# EAGLE design V15_USB_isolator (EAGLE 9.3.0)
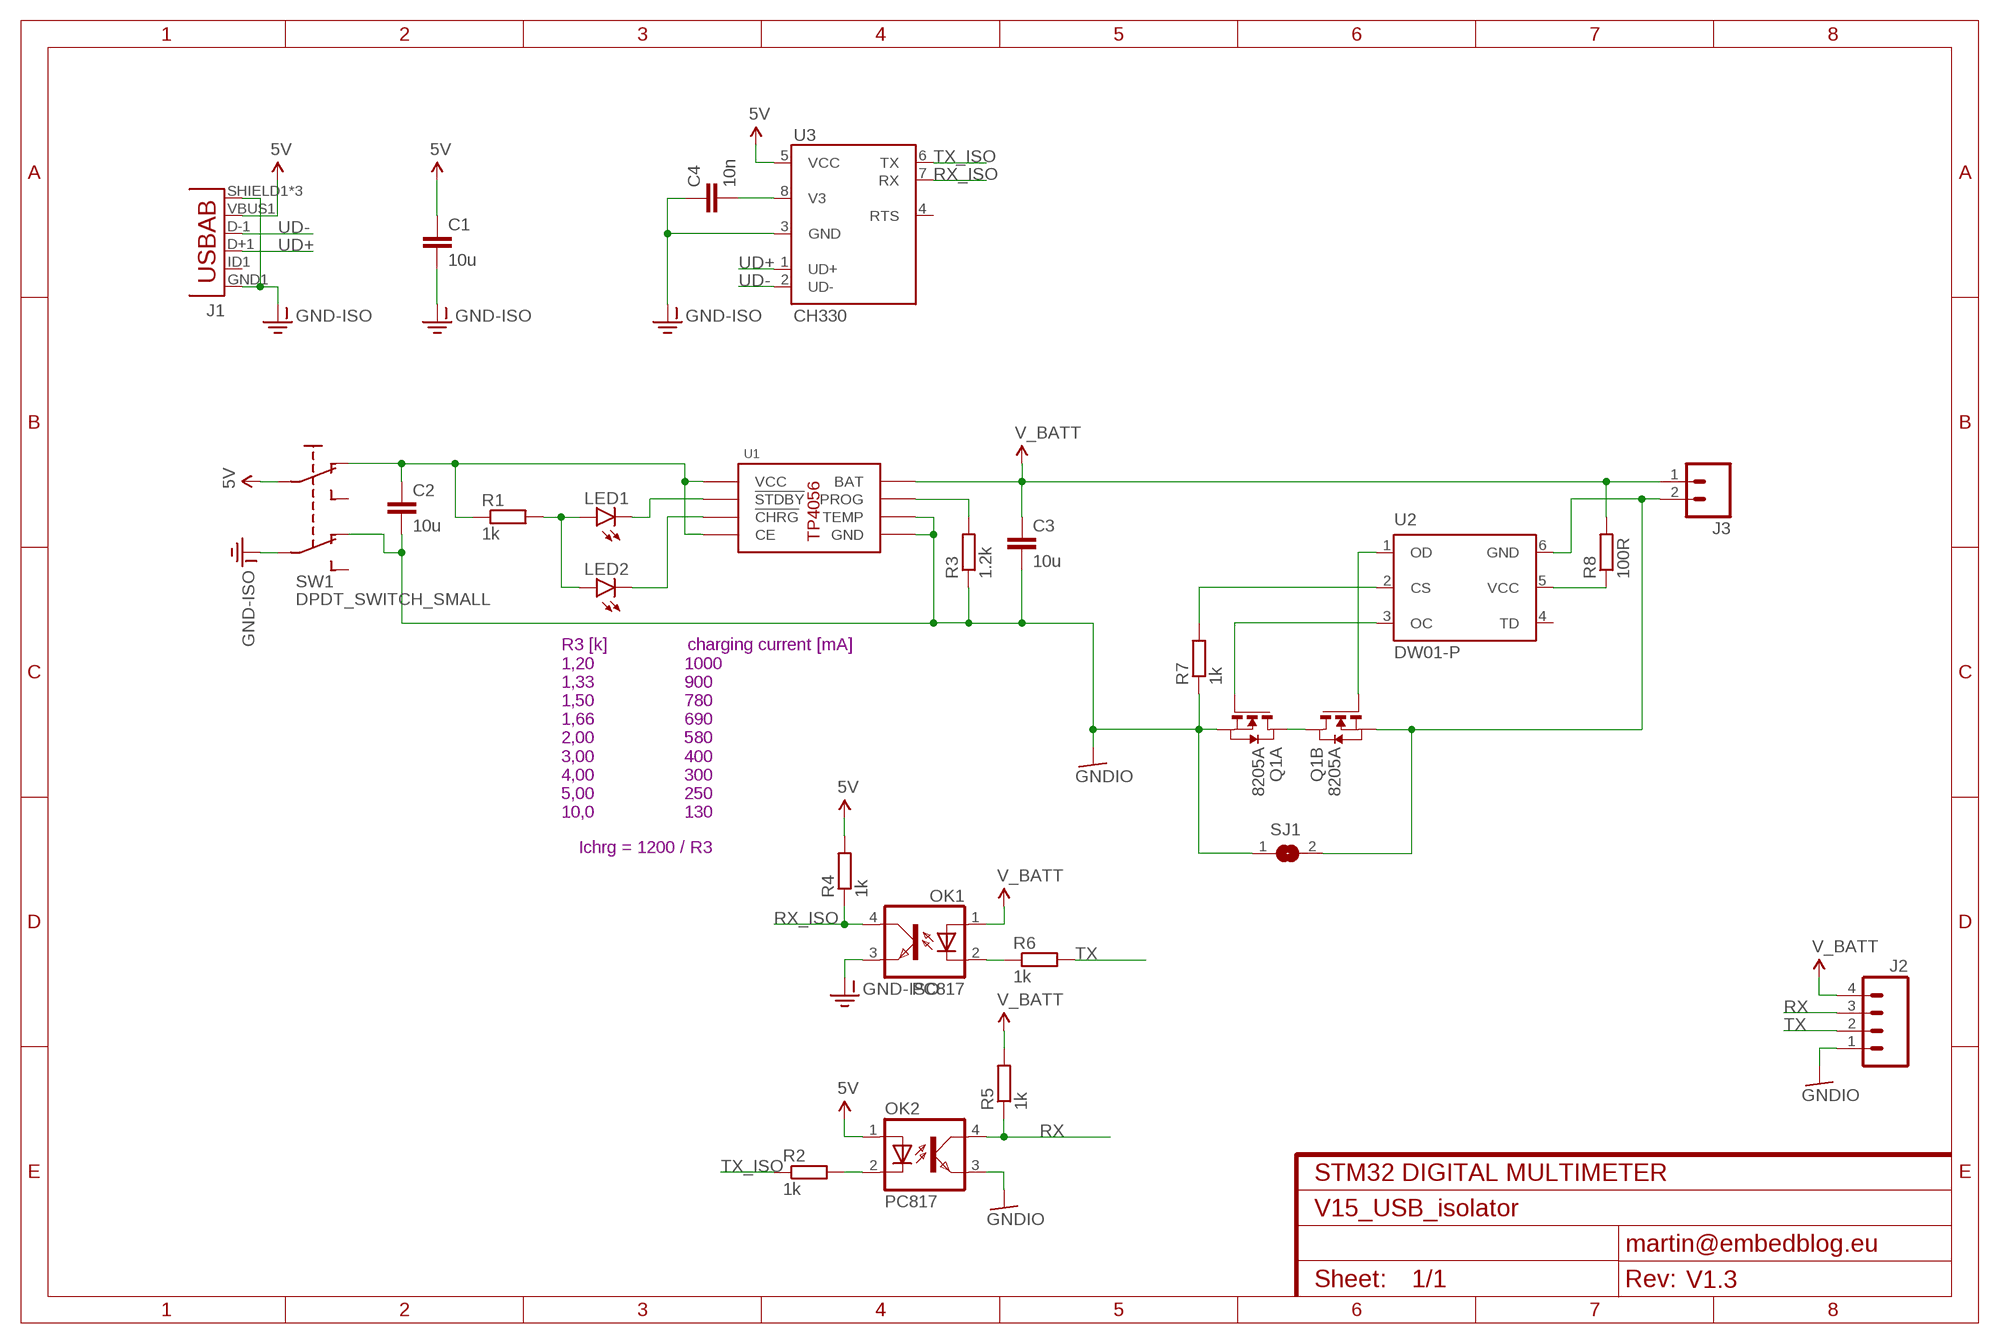
[diagram p0: schematic, sheet 1]
FRAME1 (FRAME-A4L): CNAME: STM32 DIGITAL MULTIMETER; CREVISION: V1.3; DESIGNER: martin@embedblog.eu

## Parts
C1  10u  C-EUC1206  [C1206]
C2  10u  C-EUC1206  [C1206]
C3  10u  C-EUC1206  [C1206]
C4  10n  C-EUC1206  [C1206]
J1  USB-ABCONN-11794  [USB-AB-MICRO-SMD_V03]
J2  M04PTH  [1X04@1]
J3  M02PTH3  [1X02_LONGPADS]
LED1  LED1206-BOTTOM  [LED-1206-BOTTOM]
LED2  LED1206-BOTTOM  [LED-1206-BOTTOM]
OK1  PC817  [DIL04]
OK2  PC817  [DIL04]
Q1  8205A  [TSSOP8]
R1  1k  R-EU_R1206  [R1206]
R2  1k  R-EU_R1206  [R1206]
R3  1.2k  R-EU_R1206  [R1206]
R4  1k  R-EU_R1206  [R1206]
R5  1k  R-EU_R1206  [R1206]
R6  1k  R-EU_R1206  [R1206]
R7  1k  R-EU_R1206  [R1206]
R8  100R  R-EU_R1206  [R1206]
SJ1  SJ  [SJ]
SW1  DPDT_SWITCH_SMALL  [DPDT_SMALL]
U1  TP4056  [SOP8]
U2  DW01-P  [SOT23-6L]
U3  CH330  [SO08]

## Nets
5V: C1.1 J1.VBUS1(VBUS) OK2.1(A) R4.2 SW1.P$2(I1) U3.5(VCC)
5V_ISO: C2.1 R1.1 SW1.P$1(NC1) U1.4(VCC) U1.8(CE)
GND-ISO: C1.2 C4.1 J1.GND1(GND) J1.SHIELD1(SHIELD) J1.SHIELD2(SHIELD) J1.SHIELD3(SHIELD) OK1.3(EMIT) SW1.P$5(I2) U3.3(GND)
GNDIO: C2.2 C3.2 J2.1 OK2.3(EMIT) Q1.2(A:S) Q1.3(A:S) R3.1 R7.1 SJ1.1 SW1.P$6(NC2) U1.1(TEMP) U1.3(GND)
N$1: C4.2 U3.8(V3)
N$2: Q1.1(A:D) Q1.8(B:D)
N$13: LED1.A LED2.A R1.2
N$23: LED1.C U1.6(!STDBY)
N$25: LED2.C U1.7(!CHRG)
N$26: R3.2 U1.2(PROG)
N$28: OK2.2(C) R2.2
N$29: OK1.2(C) R6.1
N$30: R8.1 U2.5(VCC)
N$31: J3.2 Q1.6(B:S) Q1.7(B:S) SJ1.2 U2.6(GND)
N$33: Q1.5(B:G) U2.1(OD)
N$34: Q1.4(A:G) U2.3(OC)
N$35: R7.2 U2.2(CS)
RX: J2.3 OK2.4(COL) R5.1
RX_ISO: OK1.4(COL) R4.1 U3.7(RX)
TX: J2.2 R6.2
TX_ISO: R2.1 U3.6(TX)
UD+: J1.D+1(D+) U3.1(UD+)
UD-: J1.D-1(D-) U3.2(UD-)
V_BATT: C3.1 J2.4 J3.1 OK1.1(A) R5.2 R8.2 U1.5(BAT)
Unconnected: J1.ID1(USBID) SW1.P$3(NO1) SW1.P$4(NO2) U2.4(TD) U3.4(RTS)

## Notes on the sheet
- R3 [k]                charging current [mA]
  1,20                  1000
  1,33                  900
  1,50                  780
  1,66                  690
  2,00                  580
  3,00                  400
  4,00                  300
  5,00                  250
  10,0                  130
- Ichrg = 1200 / R3

## Library data of the parts
C1-C4 = resistor:C-EU: CAPACITOR, European symbol
J1 = SparkFun-Connectors:USB-AB: This is a USB AB connector that is compatible with USB OTG. i.e. this connector can serve as a host or device; PROD_ID: CONN-11794
J2 = SparkFun-Connectors:M04: Header 4 Standard 4-pin 0.1" header. Use with straight break away headers (SKU : PRT-00116), right angle break away headers (PRT-00553), swiss pins (PRT-00743), machine pins (PRT-00117), and female headers (PRT-00115). Molex polarized connector foot print use with SKU : PRT-08231 with associated crimp pins and housings. 1MM SMD Version SKU: PRT-10208; PROD_ID: CONN-09696
J3 = SparkFun-Connectors:M02: Standard 2-pin 0.1" header. Use with - straight break away headers ( PRT-00116) - right angle break away headers (PRT-00553) - swiss pins (PRT-00743) - machine pins (PRT-00117) - female headers (PRT-00115) Molex polarized connector foot print use with: PRT-08233 with associated crimp pins and housings. 2.54_SCREWTERM for use with PRT-10571. 3.5mm Screw Terminal footprints for PRT-08084 5mm Screw Terminal footprints for use with PRT-08432
LED1 LED2 = SparkFun-LED:LED: LED (Generic) Standard schematic elements and footprints for 5mm, 3mm, 1206, and 0603 sized LEDs. Generic LEDs with no color specified.
OK1 OK2 = optocoupler:PC817: SHARP OPTO COUPLER; MPN: PC817X4J000F; OC_FARNELL: 9707727; OC_NEWARK: 97K7059
Q1 = lipo:8205A: DUAL N-CHANNEL MOSFET The 8205A uses advanced trench technology to provide excellent RDS(ON), low gate charge and operation with gate voltages as low as 2.5V. This device is suitable for use as a Battery protection or in other Switching application.
R1-R8 = resistor:R-EU_: RESISTOR, European symbol
SJ1 = jumper:SJ: SMD solder JUMPER
SW1 = custom:DPDT_SWITCH_SMALL
U1 = custom:TP4056
U2 = lipo:DW01-P: One Cell Lithium-ion/Polymer Battery Protection IC The DW01-P battery protection IC is designed to protect lithium-ion/polymer battery from damage or degrading the lifetime due to overcharge, overdischarge, and/or overcurrent for one-cell lithium-ion/polymer battery powered systems, such as cellular phones. The ultra-small package and less required external components make it ideal to integrate the DW01-P into the limited space of battery pack. The accurate ±50mV overcharging detection voltage ensures safe and full utilization charging. The very low standby current drains little current from the cell while in storage.
U3 = custom:CH330

## Board
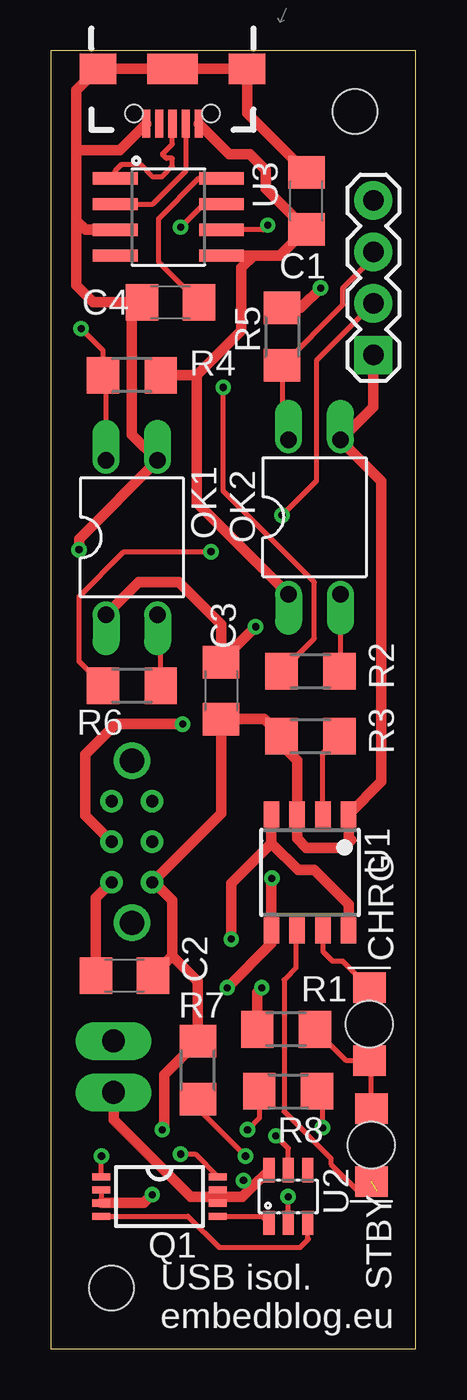
[diagram p1: board, top side]
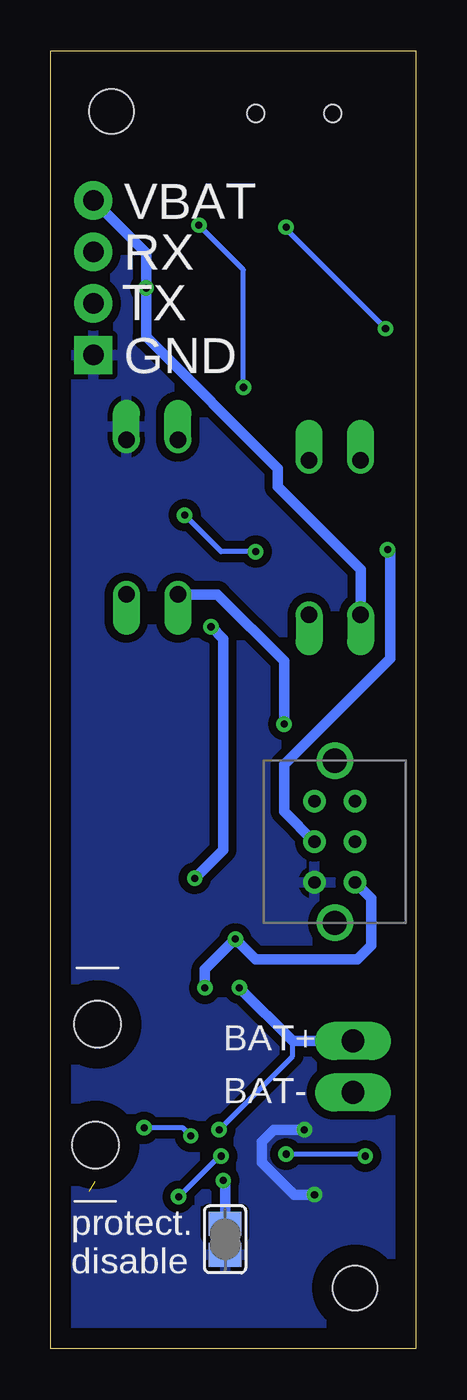
[diagram p2: board, bottom side, seen from below]

Size 18 x 64 mm. Coordinates in mm from the lower left corner, seen from the top.
Outline: 0,0 18,0 18,64 0,64 0,0
Copper layers (1*16): Top 0.035mm / dielectric 1.5mm / Bottom 0.035mm
Design rules "default": minimum track width 6mil, minimum drill 0.35mm, track to track 6mil, track to pad 6mil, pad to pad 6mil, via to via 6mil, smd to smd 6mil, copper to edge 40mil, drill to drill 6mil, minimum pad ring 10mil, minimum via ring 8mil, stop-mask expansion 4mil, vias tented up to drill 0mil, thermal gap 10mil
Holes 2.2 mm at 15,61 3,3

### Footprints (pad centres in the part's own frame; a part is rotated, then mirrored left to right if it is on the bottom)
C1206 = smd 1.6 x 1.8: 1 -1.4,0; 2 1.4,0
USB-AB-MICRO-SMD_V03 = smd 1.4 x 0.4: D+1 2.7,0; D-1 2.7,0.65; GND1 2.7,-1.3; ID1 2.7,-0.65; VBUS1 2.7,1.3 | smd 1.5 x 1.8: SHIELD1 0,3.68; SHIELD3 0,-3.68 | smd 1.5 x 2.5: SHIELD2 0,0 | hole 0.85: 2.2,1.9; 2.2,-1.9
1X04@1 = drill 1.016 pad 1.88 square: 1 0,0 | drill 1.016 pad 1.88: 2 2.54,0; 3 5.08,0; 4 7.62,0
1X02_LONGPADS = drill 1.118 pad 1.88 long: 1 0,0; 2 2.54,0
LED-1206-BOTTOM = smd 1.5 x 1.6: A -1.8,0; C 1.8,0 | hole 2.3: 0,0
DIL04 = drill 0.813 offset: 1 -1.27,-3.81; 2 1.27,-3.81; 3 1.27,3.81; 4 -1.27,3.81
TSSOP8 = smd 0.9 x 0.35: 1 -2.875,0.975; 2 -2.875,0.325; 3 -2.875,-0.325; 4 -2.875,-0.975; 5 2.875,-0.975; 6 2.875,-0.325; 7 2.875,0.325; 8 2.875,0.975
R1206 = smd 1.6 x 1.803: 1 -1.422,0; 2 1.422,0
SJ = smd 1.168 x 1.6: 1 -0.762,0; 2 0.762,0
DPDT_SMALL = drill 0.6: P$1 0,0; P$2 2,0; P$3 4,0; P$4 4,2; P$5 2,2; P$6 0,2 | drill 1.2: P$7 -2,1; P$8 6,1
SOP8 = smd 0.76 x 1.27: 1 -1.905,-2.86; 2 -0.635,-2.86; 3 0.635,-2.86; 4 1.905,-2.86; 5 1.905,2.86; 6 0.635,2.86; 7 -0.635,2.86; 8 -1.905,2.86
SOT23-6L = smd 0.55 x 1.2: 1 -0.95,-1.3; 2 0,-1.3; 3 0.95,-1.3; 4 0.95,1.3; 5 0,1.3; 6 -0.95,1.3
SO08 = smd 0.61 x 2.21: 1 -1.905,-2.616; 2 -0.635,-2.616; 3 0.635,-2.616; 4 1.905,-2.616; 5 1.905,2.616; 6 0.635,2.616; 7 -0.635,2.616; 8 -1.905,2.616

### Placement (x,y rotation side)
C1  12.6,56.6 90 top
C2  3.63,18.4 0 top
C3  8.4,32.45 270 top
C4  5.9,51.6 0 top
J1  6,63.1 270 top
J2  15.9,49 90 top
J3  3.1,15.18 270 top
LED1  15.8,10.05 270 top
LED2  15.7,16 90 top
OK1  4,40 0 top
OK2  13,41 0 top
Q1  5.36,7.51 0 top
R1  11.6,15.75 0 top
R2  12.8,33.4 0 top
R3  12.8,30.2 0 top
R4  4,48 0 top
R5  11.4,49.9 90 top
R6  4,32.7 180 top
R7  7.25,13.74 270 top
R8  11.7,12.7 180 top
SJ1  9.4,5.4 90 bottom
SW1  3,23 90 bottom
U1  12.78,23.49 180 top
U2  11.71,7.51 0 top
U3  5.8,55.8 270 top

### Tracks (layer width: path | path; a pad name or v marks a point on that pad's centre or on a via)
5V  (via drill 0.35)
  Top 0.508: J1.VBUS1 8.8,58.9 9.8,58.9 10.6,58.1 10.6,57.2 C1.1 11.29,53.89 10,53.89 | U3.5 10,53.89 | 10,53.89 9.4,53.3 9.4,50.2 7.2,48 | 7.2,48 R4.2 | OK2.1 7.2,41.72 7.2,48 | SW1.P$2 1.7,26.3 1.7,29.3 3.2,30.8 v6.5,30.8
  Bottom 0.508: OK2.1 9.79,37.19 6.5,33.9 v6.5,30.8
5V_ISO  (via drill 0.35)
  Top 0.508: U1.8 14.69,21.91 13,23.6 12.2,23.6 10.88,24.92 | 10.88,24.92 U1.4 | C2.1 2.23,22.23 SW1.P$1 | R1.1 10.18,17.58 v10.4,17.8 | v8.9,20.2 8.9,22.95 10.88,24.92
  Bottom 0.508: v10.4,17.8 10.4,18.7 v8.9,20.2 7.9,19.2 2.9,19.2 2.2,19.9 2.2,22.2 SW1.P$1
GND-ISO  (via drill 0.35)
  Top 0.254: C4.1 4,51.1 4,50.8
  Top 0.508: U3.3 1.74,55.17 1.27,55.63 | 1.27,55.63 1.27,59 | 1.27,59 1.27,62.05 J1.SHIELD3 J1.SHIELD2 J1.SHIELD1 9.68,60.92 C1.2 | J1.GND1 3.4,59.1 1.37,59.1 1.27,59 | 1.27,55.63 1.27,52.43 2.1,51.6 C4.1 | v1.39,39.4 1.39,39.93 OK1.3 4,45.08 4,50.8
  Bottom 0.508: v1.39,39.4 1.27,39.28 1.27,34.03 6.5,28.8 6.5,26.5 SW1.P$5
GNDIO  (via drill 0.35)
  Top 0.254: Q1.2 Q1.3
  Top 0.508: C2.2 6,19.37 | 6,19.37 6,22.1 5.1,23 SW1.P$6 8.4,26.4 C3.2 10.53,31.05 R3.1 11.38,29.77 12.14,29 U1.3 12.14,25.16 12.6,24.7 14.4,24.7 14.8,25.1 14.69,25.22 U1.1 16.3,27.97 16.3,42.78 OK2.3 15.9,46.44 J2.1 | 6,19.37 7.25,18.12 R7.1 5.6,13.51 5.6,10.9 v5.5,10.8 | Q1.3 4.58,7.18 v5,7.6
  Bottom 0.508: v5,7.6 6,7.6 7.6,9.2 7.6,10.2 7,10.8 v5.5,10.8
  pour Bottom (isolate 0.406): 0,0 18,0 18,64 0,64
N$1
  Top 0.254: U3.8 7.3,57.7 5.3,55.7 5.3,53.6 C4.2
N$2  (via drill 0.35)
  Top 0.254: Q1.1 2.48,9.48 v2.5,9.5 | v6.4,9.6 7.12,9.6 Q1.8
  Bottom 0.254: v6.4,9.6 2.6,9.6 v2.5,9.5
N$13
  Top 0.254: LED1.A 15.8,14.1 LED2.A 14.57,14.2 R1.2
N$23  (1 unrouted)
  Top 0.254: U1.6 12.1,20.59 12.1,18.8 11.5,18.2 11.5,11.7 13.81,9.39 13.81,9.1 15.15,7.76 16.1,7.76
N$25
  Top 0.254: U1.7 13.41,19.59 13.9,19.1 14.4,19.1 LED2.C
N$26
  Top 0.254: U1.2 13.41,29.39 R3.2
N$28
  Top 0.254: OK2.2 14.27,33.45 R2.2
N$29
  Top 0.254: R6.1 5.42,36.04 OK1.2
N$30  (via drill 0.35)
  Top 0.254: U2.5 11.71,9.89 v11.1,10.5 | v13.4,10.9 13.4,12.42 R8.1
  Bottom 0.254: v11.1,10.5 11.5,10.9 v13.4,10.9
N$31  (via drill 0.35)
  Top 0.254: Q1.7 8.23,7.5 Q1.6
  Top 0.508: J3.2 3.1,11.3 6.9,7.5 8.23,7.5 9.45,7.5 9.88,7.93 | U2.6 9.88,7.93 | v9.5,8.3 9.88,7.93
  Bottom 0.508: SJ1.2 9.4,8.2 v9.5,8.3
N$33
  Top 0.254: Q1.5 10.44,6.54 U2.1
N$34
  Top 0.254: Q1.4 6.76,6.54 8.3,5 12.3,5 12.7,5.4 12.66,5.44 U2.3
N$35  (via drill 0.35)
  Top 0.254: U2.2 v11.71,7.49 v11.7,7.5 | v9.6,9.5 7.25,11.85 R7.2
  Bottom 0.254: v11.7,7.5 9.7,9.5 v9.6,9.5
RX
  Top 0.254: OK2.4 11.4,45.14 R5.1 14.4,51.48 14.4,52.3 15.9,53.8 J2.3
RX_ISO  (via drill 0.35)
  Top 0.254: OK1.4 2.73,47.85 R4.1 2.58,49.22 v1.5,50.3 | v6.4,55.3 7.54,56.44 U3.7
  Bottom 0.254: v1.5,50.3 6.4,55.2 v6.4,55.3
TX  (via drill 0.35)
  Top 0.254: J2.2 13.1,48.74 13.1,42.8 v11.4,41.1 | R6.2 1.4,33.88 1.4,37.1 3.6,39.3 v7.9,39.3
  Bottom 0.254: v7.9,39.3 9.6,39.3 v11.4,41.1
TX_ISO  (via drill 0.35)
  Top 0.254: R2.1 13,35.02 13,37.8 8.5,42.3 v8.5,47.4 | v10.7,55.4 10.46,55.17 U3.6
  Bottom 0.254: v8.5,47.4 8.5,53.2 v10.7,55.4
UD+
  Top 0.254: U3.1 3.18,58.08 3.5,58.4 4.4,58.4 5,57.8 5.5,57.8 6,58.3 6,58.7 5.7,58.7 5.5,58.9 6,59.4 J1.D+1
UD-
  Top 0.254: U3.2 5.04,56.44 6.65,58.05 J1.D-1
V_BATT  (via drill 0.35)
  Top 0.254: R8.2 10.28,11.38 v9.7,10.8
  Top 0.508: v13.3,52.3 12.32,51.32 R5.2 | OK1.1 4.34,37.8 6.3,37.8 8.4,35.7 C3.1 8.4,33.9 v10.1,35.6 | v8.7,17.8 10.88,19.98 U1.5 10.88,23.17 v10.9,23.2
  Bottom 0.254: v9.7,10.8 6.08,14.42 6.08,15.18
  Bottom 0.508: J2.4 13.3,54.02 v13.3,52.3 13.3,49.9 6.8,43.4 6.8,42.5 2.73,38.43 OK1.1 | J3.1 6.08,15.18 v8.7,17.8 | v10.9,23.2 9.5,24.6 9.5,32 9.5,32.4 9.5,35 v10.1,35.6

### Text on the board
tPlace: CHRG | STBY | USB isol. / embedblog.eu
bPlace: VBAT | RX | TX | GND | BAT+ | BAT- | protect. / disable